# Altium schematic sheet 00_TOP.SchDoc: Top Level Schematic
size A4; SheetNumber: 1; SheetTotal: 3; PageSetup: Record=PageOptions|CenterHorizontal=True|CenterVertical=True|PrintScale=1.09|XCorrection=1.00|YCorrection=1.00|PrintKind=0|BorderSize=5000000|LeftOffset=0|BottomOffset=0|Orientation=2|PaperLength=1000|PaperWidth=1000|Scale=100|PaperSource=7|PrintQuality=-3|MediaType=1|DitherType=10|PrintScaleMode=1|PaperKind=A4|PaperIndex=9; SK_ProjectName: Analog Resource Monitor; Version: R01
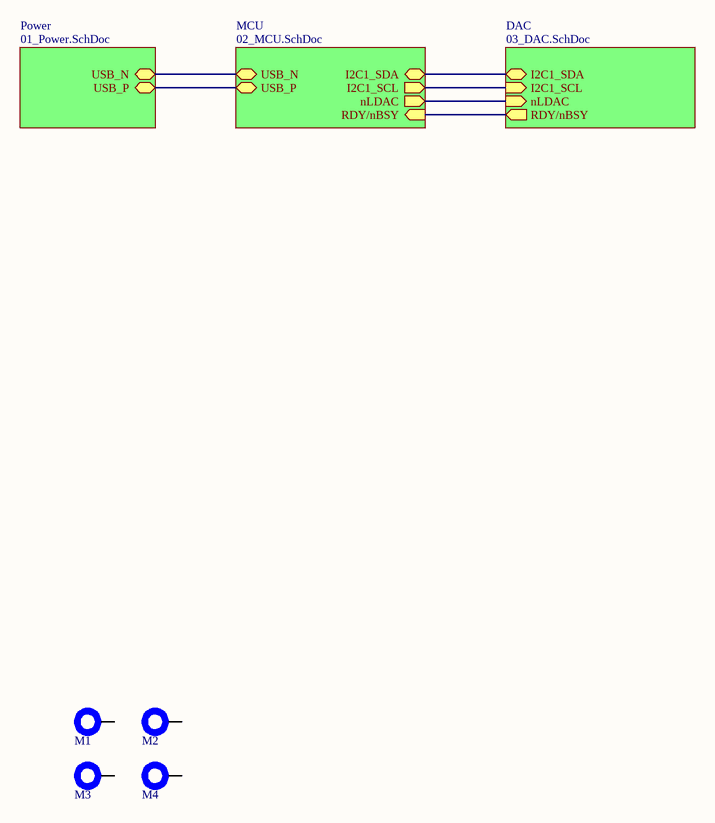
[diagram p0: 00_TOP.SchDoc]

## Parts
M1  Mounting Hole  [Mounting Hole]  (value not drawn)
M2  Mounting Hole  [Mounting Hole]  (value not drawn)
M3  Mounting Hole  [Mounting Hole]  (value not drawn)
M4  Mounting Hole  [Mounting Hole]  (value not drawn)

## Sub-sheets
DAC = 03_DAC.SchDoc: I2C1_SCL (in), nLDAC (in), I2C1_SDA (bidir), RDY/nBSY (out)
MCU = 02_MCU.SchDoc: USB_N (bidir), USB_P (bidir), I2C1_SDA (bidir), I2C1_SCL (out), nLDAC (out), RDY/nBSY (in)
Power = 01_Power.SchDoc: USB_N (bidir), USB_P (bidir)

## Nets
(unnamed): sheet Power/USB_N, sheet MCU/USB_N
(unnamed): sheet Power/USB_P, sheet MCU/USB_P
(unnamed): sheet MCU/I2C1_SDA, sheet DAC/I2C1_SDA
(unnamed): sheet MCU/I2C1_SCL, sheet DAC/I2C1_SCL
(unnamed): sheet MCU/nLDAC, sheet DAC/nLDAC
(unnamed): sheet MCU/RDY/nBSY, sheet DAC/RDY/nBSY

Not connected (* = marked no-connect by the designer): M1 0; M2 0; M3 0; M4 0

## Notes on the sheet
- Title:
- Project:
- Version:
- sasakaranovic.com
- Sasa Karanovic
- Project available at
- Date:
- Time:
- Sheet
- of

## Library data of the parts
M1-M4 = Mounting Hole: Board Mounting Hole